# EAGLE schematic adalogger featherwing (EAGLE 6.4)
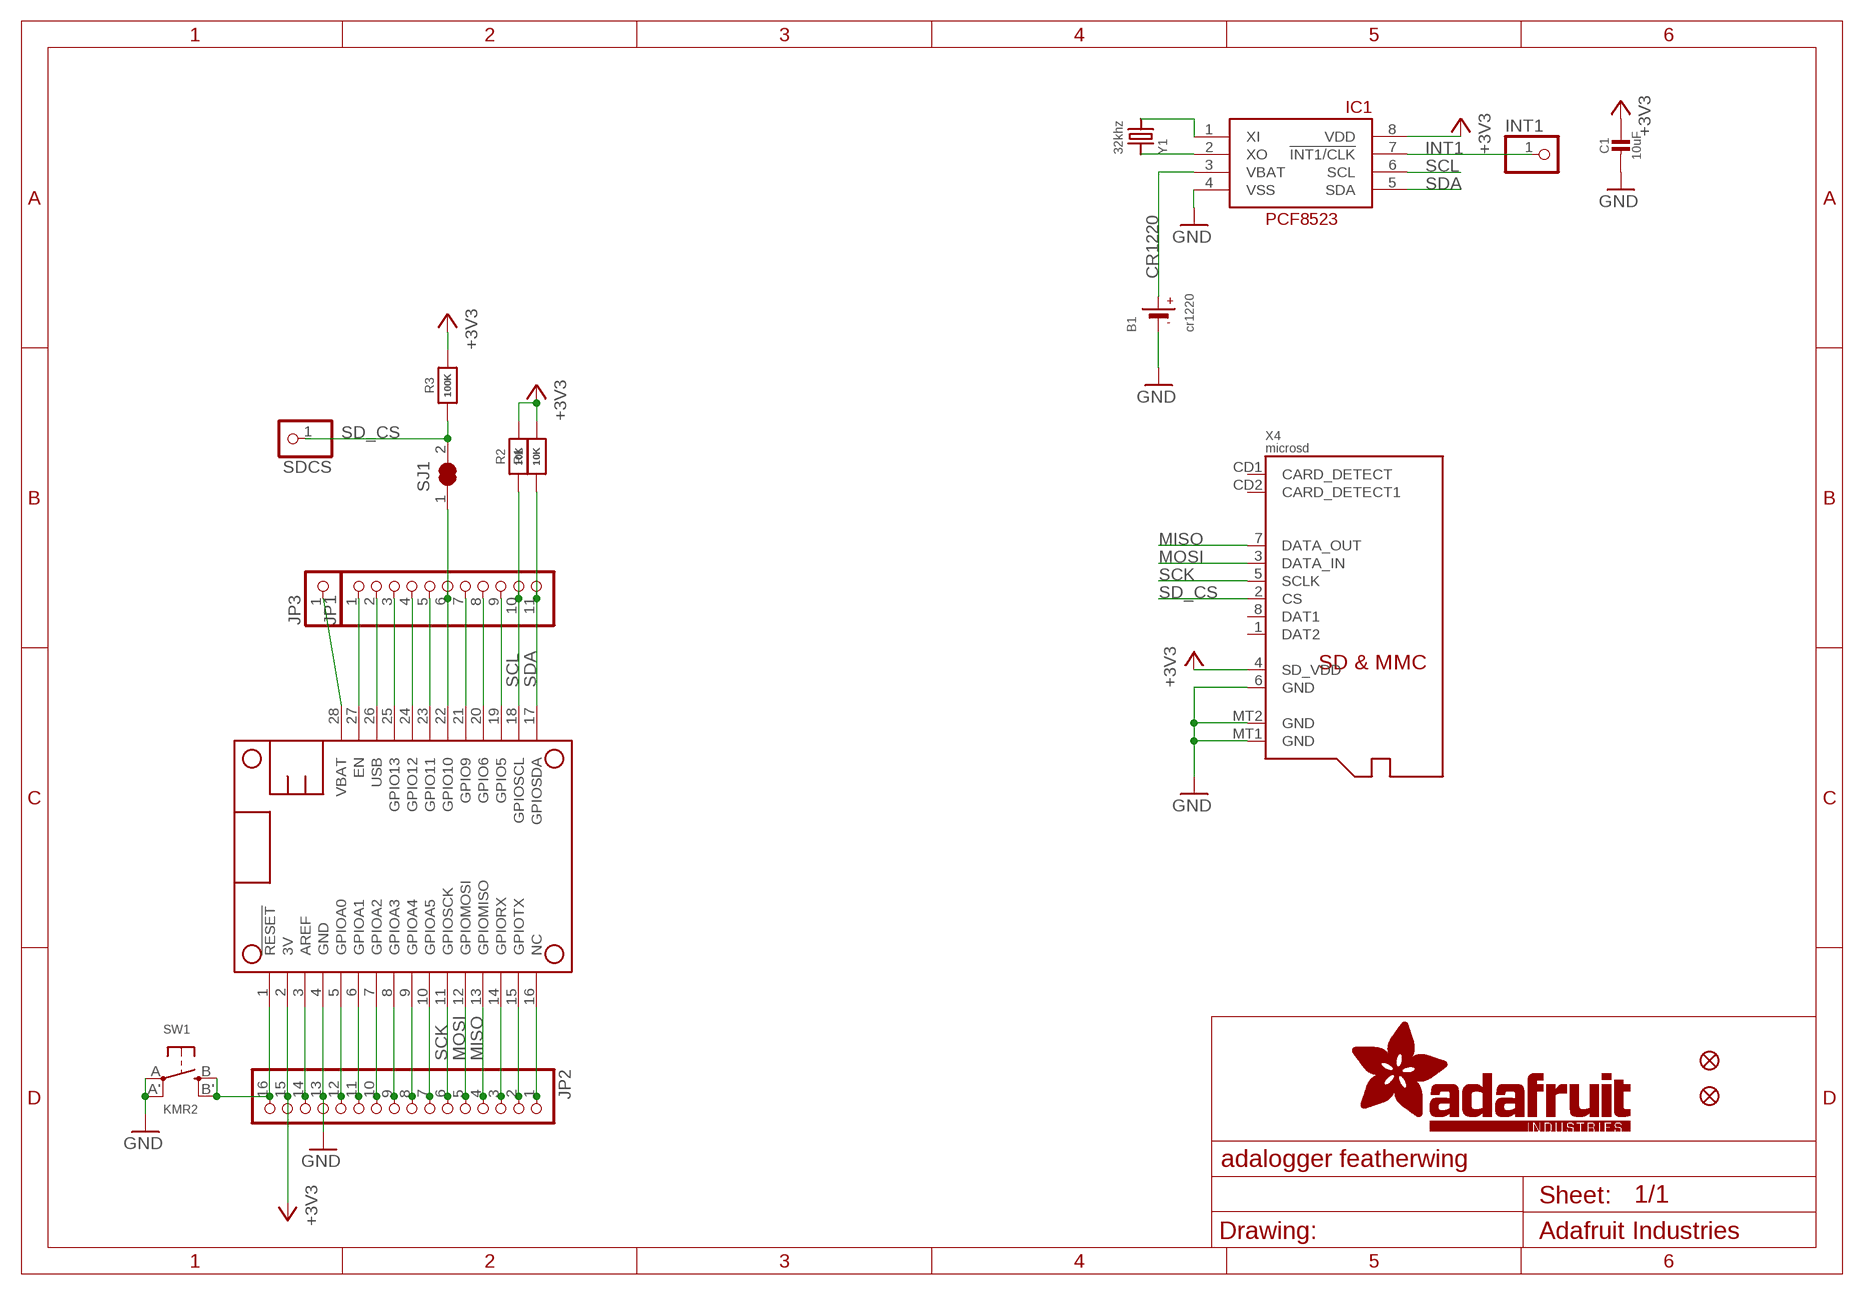
[diagram p0: schematic, sheet 1]

## Parts
B1  cr1220  BATTERYCR1220_2  [CR1220-2]
C1  10uF  CAP_CERAMIC0805-NOOUTLINE  [0805-NO]
FID1  FIDUCIAL""  [FIDUCIAL_1MM]
FID2  FIDUCIAL""  [FIDUCIAL_1MM]
IC1  RTC_PCF8523T  [SOIC8_150MIL]
INT1  HEADER-1X1ROUND  [1X01_ROUND]
JP1  HEADER-1X11  [1X11_ROUND]
JP2  HEADER-1X16ROUND  [1X16_ROUND]
JP3  HEADER-1X1ROUND  [1X01_ROUND]
MS1  FEATHERWING_NODIM  [FEATHERWING_DIM]
R1  10K  RESISTOR0805_NOOUTLINE  [0805-NO]
R2  10K  RESISTOR0805_NOOUTLINE  [0805-NO]
R3  100K  RESISTOR0805_NOOUTLINE  [0805-NO]
SDCS  HEADER-1X1ROUND  [1X01_ROUND]
SJ1  SOLDERJUMPER_CLOSED  [SOLDERJUMPER_CLOSEDWIRE]
SW1  KMR2  SWITCH_TACT_SMT4.6X2.8  [BTN_KMR2_4.6X2.8]
X4  microsd  MICROSD  [MICROSD]
Y1  32khz  CRYSTAL8.0X3.8  [CRYSTAL_8X3.8]

## Nets
+3V3: C1.1 IC1.8(VDD) JP2.15 MS1.2(3V) R1.2 R2.2 R3.2 X4.4(SD_VDD)
CR1220: B1.+ IC1.3(VBAT)
D10: JP1.6 MS1.22(GPIO10) SJ1.1
GND: B1.- C1.2 IC1.4(VSS) JP2.13 MS1.4(GND) SW1.A'(P1) SW1.A(P) X4.6(GND) X4.MT1(GND) X4.MT2(GND)
INT1: IC1.7(!INT1/CLK) INT1.1
MISO: JP2.4 MS1.13(GPIOMISO) X4.7(DATA_OUT)
MOSI: JP2.5 MS1.12(GPIOMOSI) X4.3(DATA_IN)
N$1: JP2.16 MS1.1(!RESET) SW1.B'(S1) SW1.B(S)
N$2: JP2.1 MS1.16(NC)
N$3: JP1.3 MS1.25(GPIO13)
N$4: JP2.2 MS1.15(GPIOTX)
N$5: JP1.4 MS1.24(GPIO12)
N$6: JP2.3 MS1.14(GPIORX)
N$7: IC1.1(XI) Y1.P$4
N$8: IC1.2(XO) Y1.P$1
N$10: JP2.7 MS1.10(GPIOA5)
N$11: JP2.8 MS1.9(GPIOA4)
N$12: JP2.9 MS1.8(GPIOA3)
N$13: JP2.10 MS1.7(GPIOA2)
N$14: JP2.11 MS1.6(GPIOA1)
N$15: JP2.12 MS1.5(GPIOA0)
N$16: JP1.1 MS1.27(EN)
N$17: JP2.14 MS1.3(AREF)
N$19: JP1.5 MS1.23(GPIO11)
N$21: JP1.7 MS1.21(GPIO9)
N$22: JP1.8 MS1.20(GPIO6)
N$23: JP1.9 MS1.19(GPIO5)
SCK: JP2.6 MS1.11(GPIOSCK) X4.5(SCLK)
SCL: IC1.6(SCL) JP1.10 MS1.18(GPIOSCL) R2.1
SD_CS: R3.1 SDCS.1 SJ1.2 X4.2(CS)
SDA: IC1.5(SDA) JP1.11 MS1.17(GPIOSDA) R1.1
USB: JP1.2 MS1.26(USB)
VBAT: JP3.1 MS1.28(VBAT)
Unconnected: X4.1(DAT2) X4.8(DAT1) X4.CD1(CARD_DETECT) X4.CD2(CARD_DETECT1)

## Library data of the parts
B1 = microbuilder:BATTERY: CR1220 SMT - Digikey: 3001K-ND CD2032 BAT-HLD-001 - Digikey: BAT-HLD-001-ND
C1 = microbuilder:CAP_CERAMIC: Ceramic Capacitors For new designs, use the packages preceded by an '_' character since they are more reliable: The following footprints should be used on most boards: _0402 - Standard footprint for regular board layouts _0603 - Standard footprint for regular board layouts _0805 - Standard footprint for regular board layouts _1206 - Standard footprint for regular board layouts For extremely tight-pitch boards where space is at a premium, the following 'micro-pitch' footprints can be used (smaller pads, no silkscreen outline, etc.): _0402MP - Micro-pitch footprint for very dense/compact boards _0603MP - Micro-pitch footprint for very dense/compact boards _0805MP - Micro-pitch footprint for very dense/compact boards _1206MP - Micro-pitch footprint for very dense/compact boards
FID1 FID2 = microbuilder:FIDUCIAL: Fiducial Alignment Points Various fiducial points for machine vision alignment.; BOM: EXCLUDE
IC1 = microbuilder:RTC_PCF8523
INT1 JP3 SDCS = microbuilder:HEADER-1X1: PIN HEADER
JP1 = microbuilder:HEADER-1X11
JP2 = microbuilder:HEADER-1X16: PIN HEADER
MS1 = microbuilder:FEATHERWING
R1-R3 = microbuilder:RESISTOR: Resistors For new designs, use the packages preceded by an '_' character since they are more reliable: The following footprints should be used on most boards: _0402 - Standard footprint for regular board layouts _0603 - Standard footprint for regular board layouts _0805 - Standard footprint for regular board layouts _1206 - Standard footprint for regular board layouts For extremely tight-pitch boards where space is at a premium, the following 'micro-pitch' footprints can be used (smaller pads, no silkscreen outline, etc.): _0402MP - Micro-pitch footprint for very dense/compact boards _0603MP - Micro-pitch footprint for very dense/compact boards _0805MP - Micro-pitch footprint for very dense/compact boards _1206MP - Micro-pitch footprint for very dense/compact boards
SJ1 = microbuilder:SOLDERJUMPER_CLOSED: Solder Jumper - Closed These solder jumpers are closed by default CLOSEDWIRE - 10 mil trace between pads that can be cut and resoldered later CLOSEDPERM - 63 mil trace between pads for a permanent connection (used to 'bridge' two signals, a shameless hack for Eagle). Can double as a test point as well (no cream layer)
SW1 = microbuilder:SWITCH_TACT_SMT: SMT Tact Switches 6x6mm - Digikey: P12940SCT-ND KMR2 (4.6x2.8mm) - Digikey: 401-1426-1-ND EVQ-PQHB55 - Light Touch, 160GF (4.5x4.5mm) - Digikey: P8090SCT-ND KMT0 - KMT021 NGJ LHS (etc.) IP68/Waterproof - Digikey: CKN10289CT-ND
X4 = microbuilder:MICROSD: MicroSD/Transflash Card Holder with SPI pinout 3M: 2908-05WB-MG 4UConnector: 19656 Footprint courtesy: Adafruit Industries
Y1 = microbuilder:CRYSTAL: Crystals HC49UP - Surface Mount Crystal 4.0MHz 18pF +/-30ppm Surface Mount Crystal [Digikey: 535-9857-1-ND] 12.0 MHz Surface Mount Crystal [Digikey: 535-9869-6-ND] 25.0 MHz Surface Mount Crystal [Digikey: 535-9078-1-ND] 2.5 x 2.0mm - MEMs SMT Crystal 16.0 MHz 10pF 20ppm 2.5 x 2.0mm Crystal [Digikey -40-85°C: 535-10923-1-ND] 3.2 x 2.5mm - MEMs SMT Crystal 12.0 MHz 8pF 15ppm 3.2 x 2.5mm Crystal [Digikey: -10-70°C: 644-1047-1-ND -40-125°C: 644-1128-1-ND] 40~85°C cheaper: 644-1173-6-ND 16.0 MHz 8pF 15ppm 3.2 x 2.5mm Crystal [Digikey: -10-70°C: 644-1049-1-ND -40-125°C: 644-1129-2-ND]-40~85°C cheaper: 644-1175-6-ND 16.0 MHz 10pF 10ppm 3.2 x 2.5mm Crystal [Digikey: 644-1100-1-ND] 27.12 MHz 18pF 30ppm 3.2 x 2.5mm Crystal [Digikey: 887-1424-1-ND] 27.12MHz 10pF 10ppm 3.2 x 2.5mm Crystal [Digikey: 887-1329-1-ND] 4.9 x 1.8mm - MEMs SMT Crystal 32.768 KHz 12.5pF 20ppm 4.9 x 1.8mm Crystal [Digikey: SE2415CT-ND] 8.0 x 3.8mm - Surface Mount Crystal 32.768kHz 12.5pF 20ppm -40°C-85°C [Digikey: 535-9166-2-ND] Cylinder 32.768KHz Cylinder Crystal (2x6mm body) [Ex. Digikey: 300-8341-2-ND]